# Altium schematic sheet v6_io_27_28_32_33.SchDoc: Virtex-6 IO Banks 27, 28, 32 & 33
size A3; Date: DO NOT USE, RATHER USE PROJ OPTIONS; DrawnBy: DO NOT USE, RATHER USE PROJ OPTIONS; Engineer: DO NOT USE, RATHER USE PROJ OPTIONS; Organization: DO NOT USE, RATHER USE PROJ OPTIONS; DocumentNumber: DO NOT USE, RATHER USE PROJ OPTIONS; Revision: DO NOT USE, RATHER USE PROJ OPTIONS; SheetNumber: 16; SheetTotal: 29; SCH_Sheet_Filename: v6_io_27_28_32_33.SchDoc; CurrentTime: DO NOT USE, RATHER USE PROJ OPTIONS; Time: DO NOT USE, RATHER USE PROJ OPTIONS; DocumentFullPathAndName: DO NOT USE, RATHER USE PROJ OPTIONS; DocumentName: DO NOT USE, RATHER USE PROJ OPTIONS; ModifiedDate: DO NOT USE, RATHER USE PROJ OPTIONS; ImagePath: DO NOT USE, RATHER USE PROJ OPTIONS
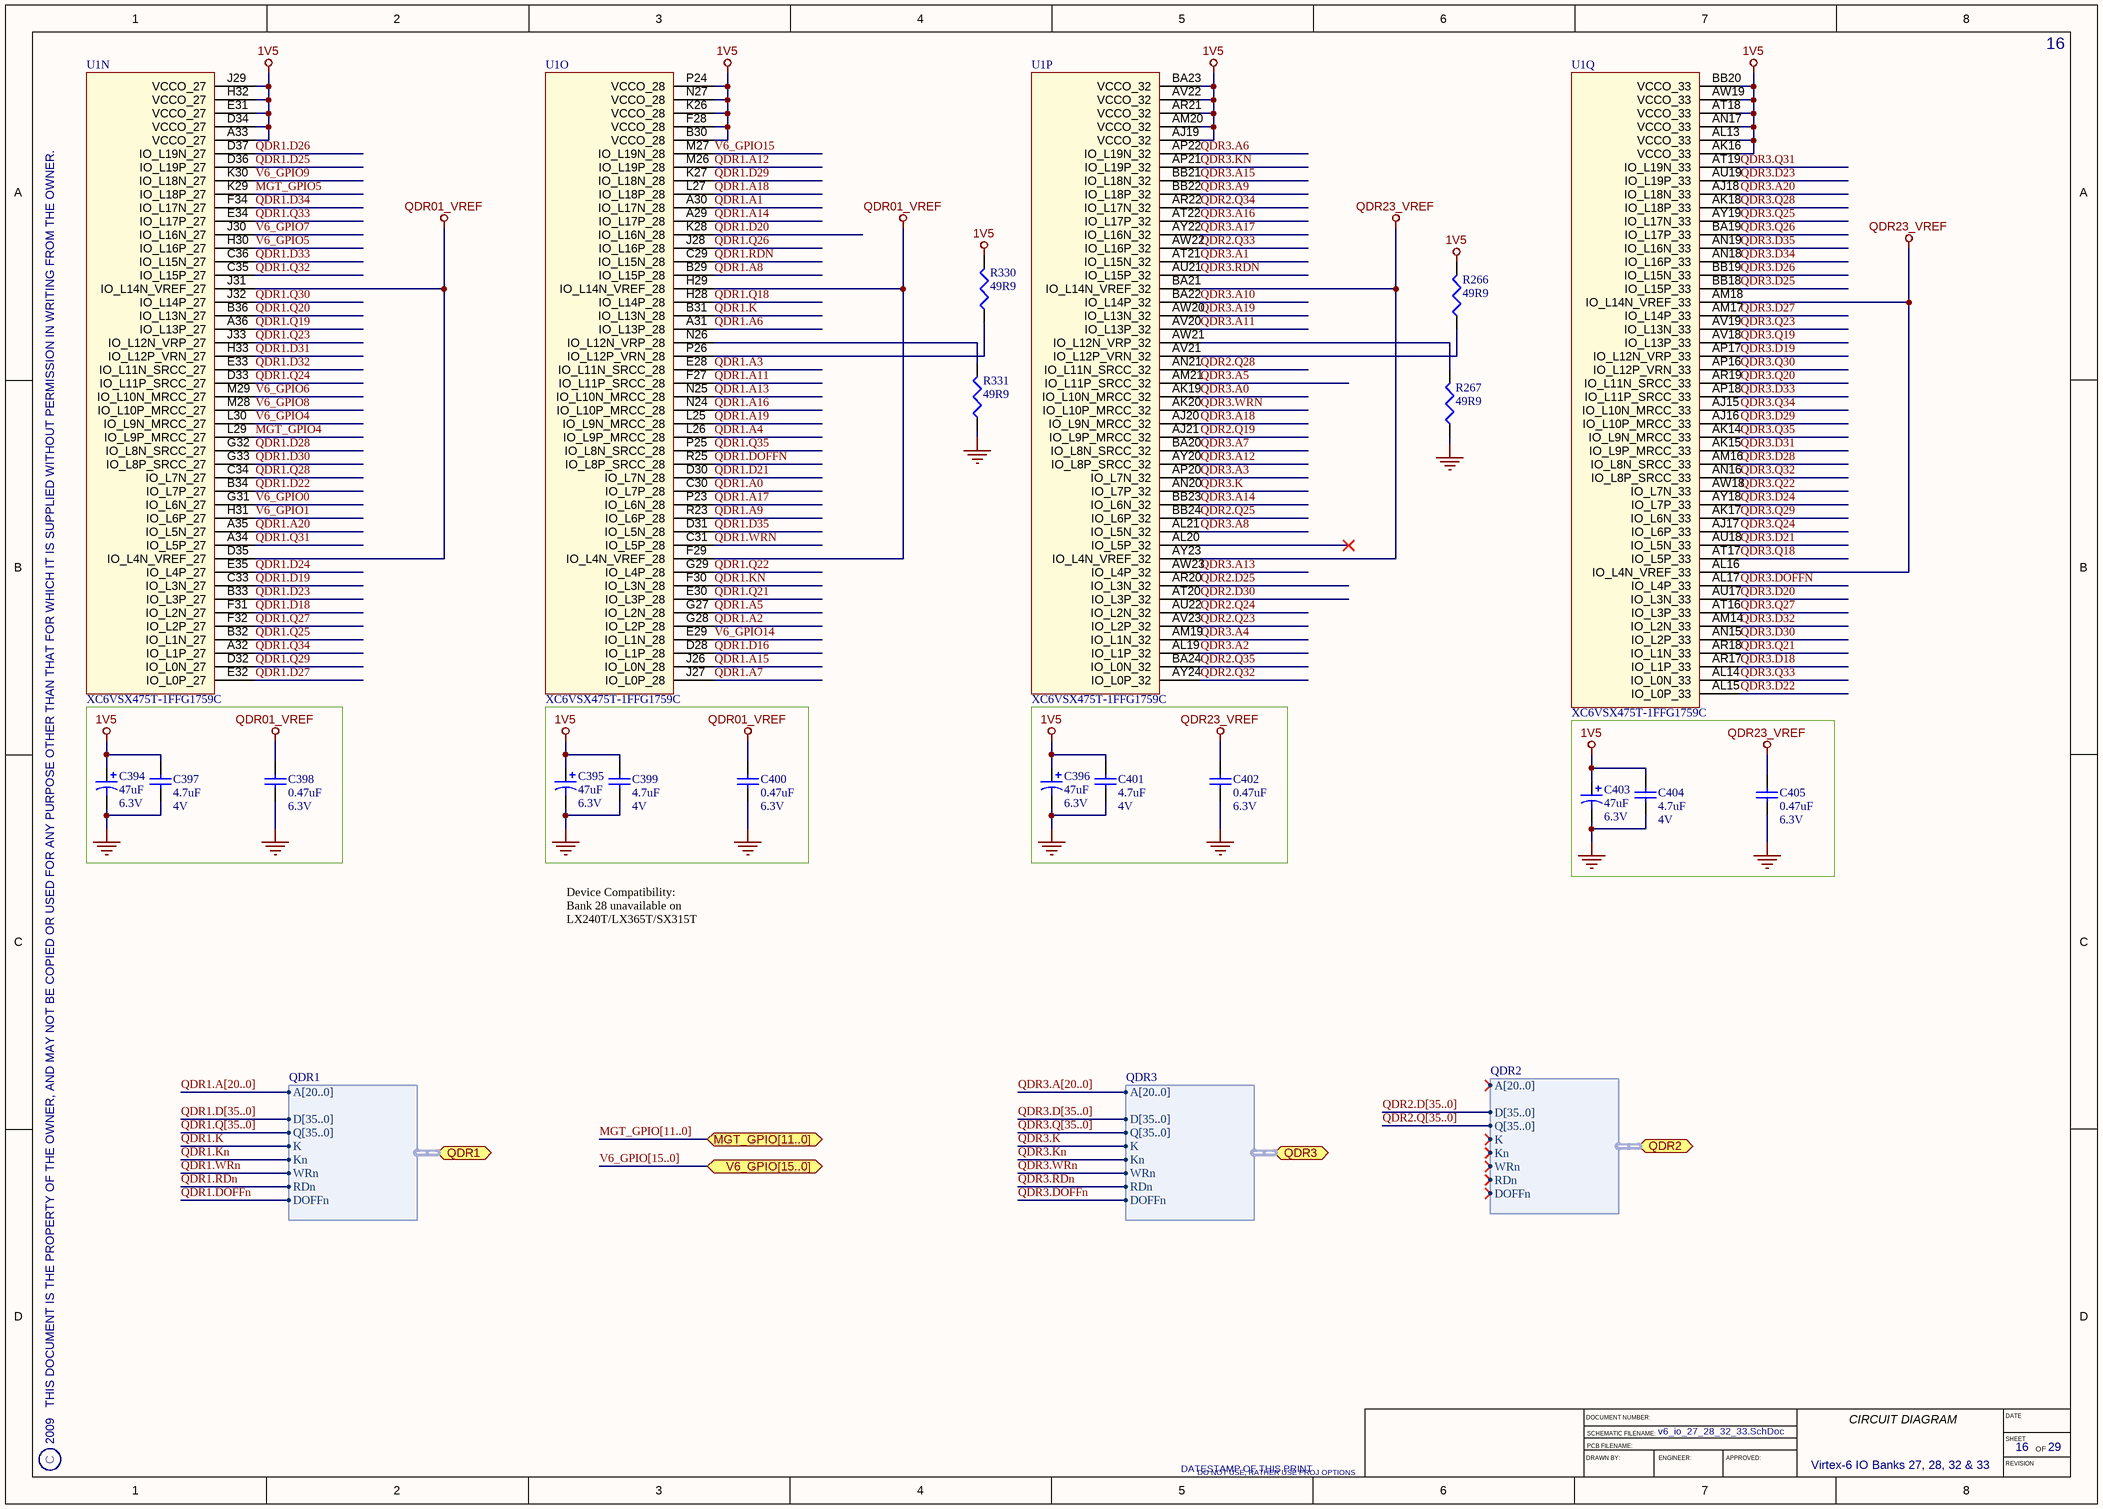
[diagram p0: v6_io_27_28_32_33.SchDoc]

## Parts
C394  Rating: 6.3V  [CAPMP3528X120L]  (hidden comment: 47uF)
C395  Rating: 6.3V  [CAPMP3528X120L]  (hidden comment: 47uF)
C396  Rating: 6.3V  [CAPMP3528X120L]  (hidden comment: 47uF)
C397  Rating: 4V  [CAPC1005X60L]  (hidden comment: 4.7uF)
C398  Rating: 6.3V  [CAPC1005X55L]  (hidden comment: 0.47uF)
C399  Rating: 4V  [CAPC1005X60L]  (hidden comment: 4.7uF)
C400  Rating: 6.3V  [CAPC1005X55L]  (hidden comment: 0.47uF)
C401  Rating: 4V  [CAPC1005X60L]  (hidden comment: 4.7uF)
C402  Rating: 6.3V  [CAPC1005X55L]  (hidden comment: 0.47uF)
C403  Rating: 6.3V  [CAPMP3528X120L]  (hidden comment: 47uF)
C404  Rating: 4V  [CAPC1005X60L]  (hidden comment: 4.7uF)
C405  Rating: 6.3V  [CAPC1005X55L]  (hidden comment: 0.47uF)
R266  49R9  [RESC1005X40L]
R267  49R9  [RESC1005X40L]
R330  49R9  [RESC1005X40L]
R331  49R9  [RESC1005X40L]
U1  XC6VSX475T-1FFG1759C  [FFG1759]  (parts N,O,P,Q of 39)

## Ports
MGT_GPIO[11..0] (bidir), QDR1 (harness QDR1), QDR2 (harness QDR2), QDR3 (harness QDR3), V6_GPIO[15..0] (bidir)

## Harnesses
QDR1: A[20..0], D[35..0], Q[35..0], K, Kn, WRn, RDn, DOFFn
QDR3: A[20..0], D[35..0], Q[35..0], K, Kn, WRn, RDn, DOFFn
QDR2: A[20..0], D[35..0], Q[35..0], K, Kn, WRn, RDn, DOFFn

## Nets
1V5: C394.1 C395.1 C396.1 C397.2 C399.2 C401.2 C403.1 C404.2 R266.2 R330.2 U1.A33(VCCO_27) U1.AJ19(VCCO_32) U1.AK16(VCCO_33) U1.AL13(VCCO_33) U1.AM20(VCCO_32) U1.AN17(VCCO_33) U1.AR21(VCCO_32) U1.AT18(VCCO_33) U1.AV22(VCCO_32) U1.AW19(VCCO_33) U1.B30(VCCO_28) U1.BA23(VCCO_32) U1.BB20(VCCO_33) U1.D34(VCCO_27) U1.E31(VCCO_27) U1.F28(VCCO_28) U1.H32(VCCO_27) U1.J29(VCCO_27) U1.K26(VCCO_28) U1.N27(VCCO_28) U1.P24(VCCO_28)
GND: C394.2 C395.2 C396.2 C397.1 C398.1 C399.1 C400.1 C401.1 C402.1 C403.2 C404.1 C405.1 R267.1 R331.1
QDR01_VREF: C398.2 C400.2 U1.D35(IO_L4N_VREF_27) U1.F29(IO_L4N_VREF_28) U1.H29(IO_L14N_VREF_28) U1.J31(IO_L14N_VREF_27)
QDR23_VREF: C402.2 C405.2 U1.AL16(IO_L4N_VREF_33) U1.AM18(IO_L14N_VREF_33) U1.AY23(IO_L4N_VREF_32) U1.BA21(IO_L14N_VREF_32)
MGT_GPIO4: U1.L29(IO_L9P_MRCC_27)
MGT_GPIO5: U1.K29(IO_L18P_27)
QDR1.A0: U1.C30(IO_L7P_28)
QDR1.A1: U1.A30(IO_L17N_28)
QDR1.A2: U1.G28(IO_L2P_28)
QDR1.A3: U1.E28(IO_L11N_SRCC_28)
QDR1.A4: U1.L26(IO_L9P_MRCC_28)
QDR1.A5: U1.G27(IO_L2N_28)
QDR1.A6: U1.A31(IO_L13P_28)
QDR1.A7: U1.J27(IO_L0P_28)
QDR1.A8: U1.B29(IO_L15P_28)
QDR1.A9: U1.R23(IO_L6P_28)
QDR1.A11: U1.F27(IO_L11P_SRCC_28)
QDR1.A12: U1.M26(IO_L19P_28)
QDR1.A13: U1.N25(IO_L10N_MRCC_28)
QDR1.A14: U1.A29(IO_L17P_28)
QDR1.A15: U1.J26(IO_L0N_28)
QDR1.A16: U1.N24(IO_L10P_MRCC_28)
QDR1.A17: U1.P23(IO_L6N_28)
QDR1.A18: U1.L27(IO_L18P_28)
QDR1.A19: U1.L25(IO_L9N_MRCC_28)
QDR1.A20: U1.A35(IO_L5N_27)
QDR1.D16: U1.D28(IO_L1P_28)
QDR1.D18: U1.F31(IO_L2N_27)
QDR1.D19: U1.C33(IO_L3N_27)
QDR1.D20: U1.K28(IO_L16N_28)
QDR1.D21: U1.D30(IO_L7N_28)
QDR1.D22: U1.B34(IO_L7P_27)
QDR1.D23: U1.B33(IO_L3P_27)
QDR1.D24: U1.E35(IO_L4P_27)
QDR1.D25: U1.D36(IO_L19P_27)
QDR1.D26: U1.D37(IO_L19N_27)
QDR1.D27: U1.E32(IO_L0P_27)
QDR1.D28: U1.G32(IO_L8N_SRCC_27)
QDR1.D29: U1.K27(IO_L18N_28)
QDR1.D30: U1.G33(IO_L8P_SRCC_27)
QDR1.D31: U1.H33(IO_L12P_VRN_27)
QDR1.D32: U1.E33(IO_L11N_SRCC_27)
QDR1.D33: U1.C36(IO_L15N_27)
QDR1.D34: U1.F34(IO_L17N_27)
QDR1.D35: U1.D31(IO_L5N_28)
QDR1.DOFFn: U1.R25(IO_L8P_SRCC_28) ; port QDR1.DOFFn
QDR1.K: U1.B31(IO_L13N_28) ; port QDR1.K
QDR1.Kn: U1.F30(IO_L3N_28) ; port QDR1.Kn
QDR1.Q18: U1.H28(IO_L14P_28)
QDR1.Q19: U1.A36(IO_L13P_27)
QDR1.Q20: U1.B36(IO_L13N_27)
QDR1.Q21: U1.E30(IO_L3P_28)
QDR1.Q22: U1.G29(IO_L4P_28)
QDR1.Q23: U1.J33(IO_L12N_VRP_27)
QDR1.Q24: U1.D33(IO_L11P_SRCC_27)
QDR1.Q25: U1.B32(IO_L1N_27)
QDR1.Q26: U1.J28(IO_L16P_28)
QDR1.Q27: U1.F32(IO_L2P_27)
QDR1.Q28: U1.C34(IO_L7N_27)
QDR1.Q29: U1.D32(IO_L0N_27)
QDR1.Q30: U1.J32(IO_L14P_27)
QDR1.Q31: U1.A34(IO_L5P_27)
QDR1.Q32: U1.C35(IO_L15P_27)
QDR1.Q33: U1.E34(IO_L17P_27)
QDR1.Q34: U1.A32(IO_L1P_27)
QDR1.Q35: U1.P25(IO_L8N_SRCC_28)
QDR1.RDn: U1.C29(IO_L15N_28) ; port QDR1.RDn
QDR1.WRn: U1.C31(IO_L5P_28) ; port QDR1.WRn
QDR2.D25: U1.AR20(IO_L3N_32)
QDR2.D30: U1.AT20(IO_L3P_32)
QDR2.Q19: U1.AJ21(IO_L9P_MRCC_32)
QDR2.Q23: U1.AV23(IO_L2P_32)
QDR2.Q24: U1.AU22(IO_L2N_32)
QDR2.Q25: U1.BB24(IO_L6P_32)
QDR2.Q28: U1.AN21(IO_L11N_SRCC_32)
QDR2.Q32: U1.AY24(IO_L0P_32)
QDR2.Q33: U1.AW22(IO_L16P_32)
QDR2.Q34: U1.AR22(IO_L17N_32)
QDR2.Q35: U1.BA24(IO_L0N_32)
QDR3.A0: U1.AK19(IO_L10N_MRCC_32)
QDR3.A1: U1.AT21(IO_L15N_32)
QDR3.A2: U1.AL19(IO_L1P_32)
QDR3.A3: U1.AP20(IO_L7N_32)
QDR3.A4: U1.AM19(IO_L1N_32)
QDR3.A5: U1.AM21(IO_L11P_SRCC_32)
QDR3.A6: U1.AP22(IO_L19N_32)
QDR3.A7: U1.BA20(IO_L8N_SRCC_32)
QDR3.A8: U1.AL21(IO_L5N_32)
QDR3.A9: U1.BB22(IO_L18P_32)
QDR3.A10: U1.BA22(IO_L14P_32)
QDR3.A11: U1.AV20(IO_L13P_32)
QDR3.A12: U1.AY20(IO_L8P_SRCC_32)
QDR3.A13: U1.AW23(IO_L4P_32)
QDR3.A14: U1.BB23(IO_L6N_32)
QDR3.A15: U1.BB21(IO_L18N_32)
QDR3.A16: U1.AT22(IO_L17P_32)
QDR3.A17: U1.AY22(IO_L16N_32)
QDR3.A18: U1.AJ20(IO_L9N_MRCC_32)
QDR3.A19: U1.AW20(IO_L13N_32)
QDR3.A20: U1.AJ18(IO_L18N_33)
QDR3.D18: U1.AR17(IO_L1P_33)
QDR3.D19: U1.AP17(IO_L12N_VRP_33)
QDR3.D20: U1.AU17(IO_L3N_33)
QDR3.D21: U1.AU18(IO_L5N_33)
QDR3.D22: U1.AL15(IO_L0P_33)
QDR3.D23: U1.AU19(IO_L19P_33)
QDR3.D24: U1.AY18(IO_L7P_33)
QDR3.D25: U1.BB18(IO_L15P_33)
QDR3.D26: U1.BB19(IO_L15N_33)
QDR3.D27: U1.AM17(IO_L14P_33)
QDR3.D28: U1.AM16(IO_L8N_SRCC_33)
QDR3.D29: U1.AJ16(IO_L10P_MRCC_33)
QDR3.D30: U1.AN15(IO_L2P_33)
QDR3.D31: U1.AK15(IO_L9P_MRCC_33)
QDR3.D32: U1.AM14(IO_L2N_33)
QDR3.D33: U1.AP18(IO_L11P_SRCC_33)
QDR3.D34: U1.AN18(IO_L16P_33)
QDR3.D35: U1.AN19(IO_L16N_33)
QDR3.DOFFn: U1.AL17(IO_L4P_33) ; port QDR3.DOFFn
QDR3.K: U1.AN20(IO_L7P_32) ; port QDR3.K
QDR3.Kn: U1.AP21(IO_L19P_32) ; port QDR3.Kn
QDR3.Q18: U1.AT17(IO_L5P_33)
QDR3.Q19: U1.AV18(IO_L13P_33)
QDR3.Q20: U1.AR19(IO_L11N_SRCC_33)
QDR3.Q21: U1.AR18(IO_L1N_33)
QDR3.Q22: U1.AW18(IO_L7N_33)
QDR3.Q23: U1.AV19(IO_L13N_33)
QDR3.Q24: U1.AJ17(IO_L6P_33)
QDR3.Q25: U1.AY19(IO_L17N_33)
QDR3.Q26: U1.BA19(IO_L17P_33)
QDR3.Q27: U1.AT16(IO_L3P_33)
QDR3.Q28: U1.AK18(IO_L18P_33)
QDR3.Q29: U1.AK17(IO_L6N_33)
QDR3.Q30: U1.AP16(IO_L12P_VRN_33)
QDR3.Q31: U1.AT19(IO_L19N_33)
QDR3.Q32: U1.AN16(IO_L8P_SRCC_33)
QDR3.Q33: U1.AL14(IO_L0N_33)
QDR3.Q34: U1.AJ15(IO_L10N_MRCC_33)
QDR3.Q35: U1.AK14(IO_L9N_MRCC_33)
QDR3.RDn: U1.AU21(IO_L15P_32) ; port QDR3.RDn
QDR3.WRn: U1.AK20(IO_L10P_MRCC_32) ; port QDR3.WRn
V6_GPIO0: U1.G31(IO_L6N_27)
V6_GPIO1: U1.H31(IO_L6P_27)
V6_GPIO4: U1.L30(IO_L9N_MRCC_27)
V6_GPIO5: U1.H30(IO_L16P_27)
V6_GPIO6: U1.M29(IO_L10N_MRCC_27)
V6_GPIO7: U1.J30(IO_L16N_27)
V6_GPIO8: U1.M28(IO_L10P_MRCC_27)
V6_GPIO9: U1.K30(IO_L18N_27)
V6_GPIO14: U1.E29(IO_L1N_28)
V6_GPIO15: U1.M27(IO_L19N_28)
NetR266_1: R266.1 U1.AV21(IO_L12P_VRN_32)
NetR267_2: R267.2 U1.AW21(IO_L12N_VRP_32)
NetR330_1: R330.1 U1.P26(IO_L12P_VRN_28)
NetR331_2: R331.2 U1.N26(IO_L12N_VRP_28)

Not connected (* = marked no-connect by the designer): U1 AL20(IO_L5P_32)*

## Buses and harness runs
bus MGT_GPIO[11..0] = port MGT_GPIO[11..0]
bus QDR1.A[20..0]
bus QDR1.D[35..0]
bus QDR1.Q[35..0]
bus QDR2.D[35..0]
bus QDR2.Q[35..0]
bus QDR3.A[20..0]
bus QDR3.D[35..0]
bus QDR3.Q[35..0]
bus V6_GPIO[15..0] = port V6_GPIO[15..0]

## Notes on the sheet
- Device Compatibility:
  Bank 28 unavailable on LX240T/LX365T/SX315T
- 2009   THIS DOCUMENT IS THE PROPERTY OF THE OWNER, AND MAY NOT BE COPIED OR USED FOR ANY PURPOSE OTHER THAN THAT FOR WHICH IT IS SUPPLIED WITHOUT PERMISSION IN WRITING FROM THE OWNER.
- C
- DATESTAMP OF THIS PRINT
- DRAWN BY:
- DOCUMENT NUMBER:
- SCHEMATIC FILENAME:
- PCB FILENAME:
- ENGINEER:
- APPROVED:
- CIRCUIT DIAGRAM
- DATE
- SHEET
- REVISION
- OF

## Library data of the parts
C394-C396 C403 = CAP-TAN-1: 47uF, Conductive Polymer Chip Capacitor; Manufacturer: KEMET; PartNum: T520T476M006ATE070; Tolerance: 20%; ESR: 0.07; POD number: CAP-TAN-1; Value: 47uF; RoHS: Y; Sort Value: 47; Category: Capacitors; Subcategory: Tantalum
C397 C399 C401 C404 = CAP-CER-11: 4.7uF, Ceramic Capacitor; Manufacturer: MURATA; PartNum: AMK105BJ475MV-F; Tolerance: 20%; Dielectric: X5R; POD number: CAP-CER-11; Value: 4.7uF; RoHS: Y; Sort Value: 4.7; Category: Capacitors; Subcategory: Ceramic
C398 C400 C402 C405 = CAP-CER-7: 0.47uF, Ceramic Capacitor; Manufacturer: MURATA; PartNum: GRM155R60J474KE19; Tolerance: 10%; Dielectric: X5R; POD number: CAP-CER-7; Value: 0.47uF; RoHS: Y; Sort Value: 0.47; Category: Capacitors; Subcategory: Ceramic
R266 R267 R330 R331 = RES-TF-10: 49R9, 1.1mm x 0.5mm, Thick Film Resistor; Manufacturer: ROYALOHM; PartNum: 0402WGF499JT1E; Tolerance: 1%; Rating: 0.0625W; POD number: RES-TF-10; Value: 49R9; Sort Value: 49.9; Category: Resistors; Subcategory: ThickFilm; HelpURL: *.pdf
U1 = IC-PLD-0: Virtex-6 475SXT 1760-pin FPGA; Manufacturer: Xilinx; POD number: IC-PLD-0; PartNum: XC6VSX475T-1FFG1759C; RoHS: Y; Category: IC; Subcategory: PLD